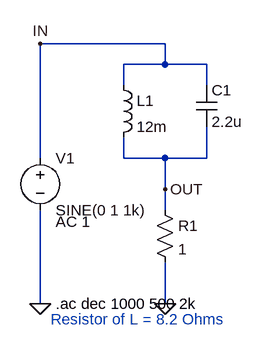
[diagram p0: schematic 2-2-2_RLC_parallel.asc]
2-2-2_RLC_parallel.asc, the LTspice schematic file:
Version 4.1
SHEET 1 880 680
WIRE 352 -64 160 -64
WIRE 352 -32 352 -64
WIRE 352 -32 288 -32
WIRE 416 -32 352 -32
WIRE 288 0 288 -32
WIRE 416 0 416 -32
WIRE 160 112 160 -64
WIRE 288 112 288 80
WIRE 352 112 288 112
WIRE 416 112 416 64
WIRE 416 112 352 112
WIRE 352 160 352 112
WIRE 352 192 352 160
WIRE 160 336 160 192
WIRE 352 336 352 272
FLAG 352 336 0
FLAG 160 336 0
FLAG 160 -64 IN
FLAG 352 160 OUT
SYMBOL ind 272 -16 R0
SYMATTR InstName L1
SYMATTR Value 12m
SYMATTR SpiceLine Rser=8.2
SYMBOL cap 400 0 R0
SYMATTR InstName C1
SYMATTR Value 2.2u
SYMBOL res 336 176 R0
SYMATTR InstName R1
SYMATTR Value 1
SYMBOL voltage 160 96 R0
WINDOW 123 24 114 Left 2
WINDOW 39 0 0 Left 0
SYMATTR Value2 AC 1
SYMATTR InstName V1
SYMATTR Value SINE(0 1 1k)
TEXT 176 360 Left 2 ;Resistor of L = 8.2 Ohms
TEXT 184 336 Left 2 !.ac dec 1000 500 2k

The netlist it stands for:
* 2-2-2_RLC_parallel.asc
L1 IN OUT 12m Rser=8.2
C1 IN OUT 2.2u
R1 OUT 0 1
V1 IN 0 SINE(0 1 1k) AC 1
* Resistor of L = 8.2 Ohms
.ac dec 1000 500 2k
.backanno
.end